# EAGLE schematic Arduino UNO blank shield (EAGLE 7.6.0)
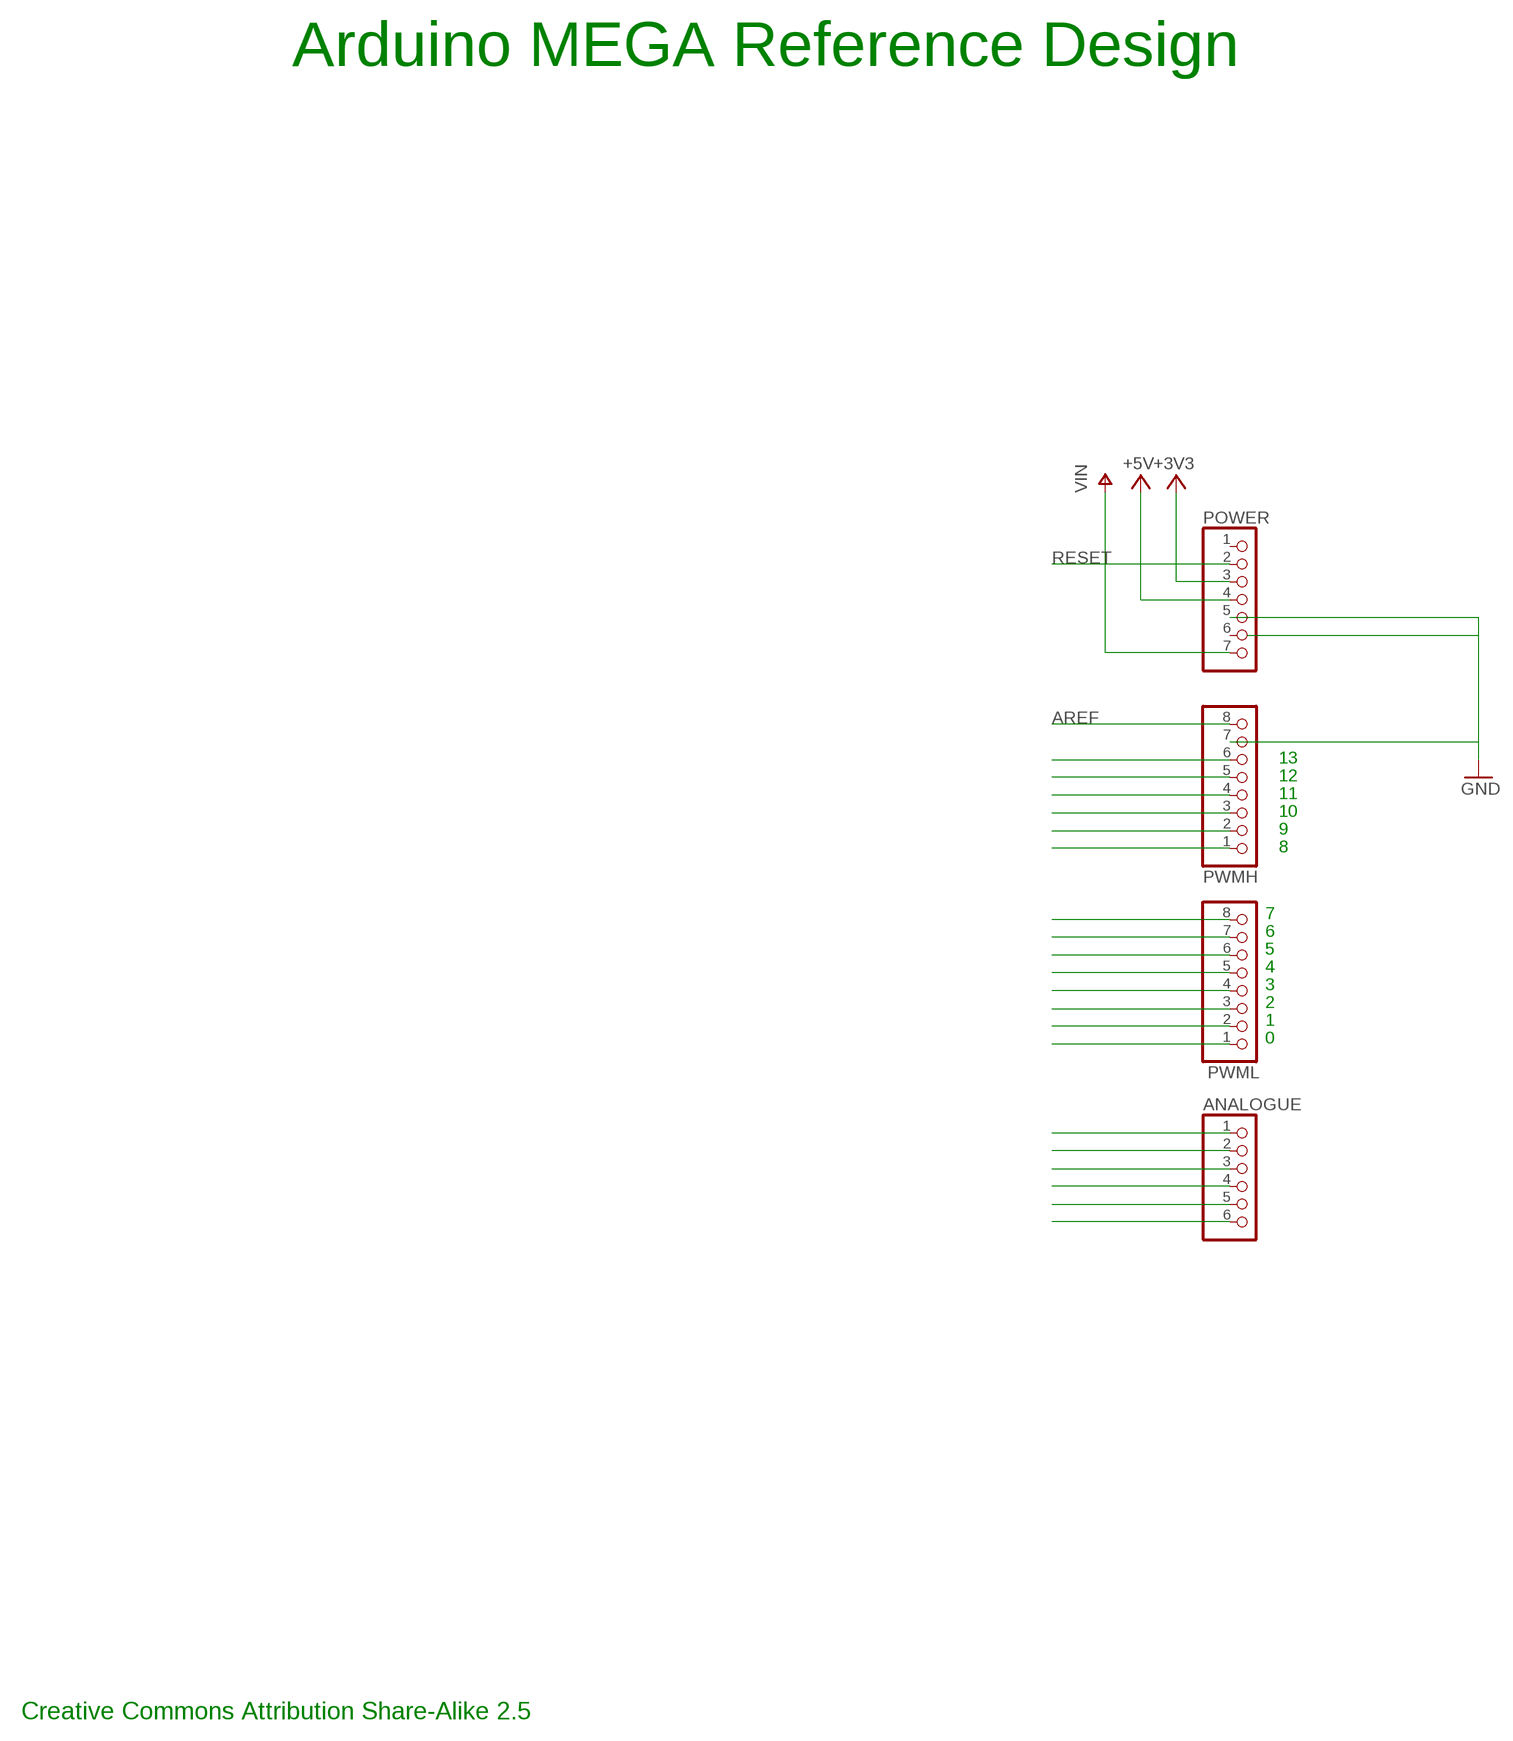
[diagram p0: schematic, sheet 1]

## Parts
ANALOGUE  PINHD-1X6  [1X06]
POWER  PINHD-1X7  [1X07]
PWMH  PINHD-1X8  [1X08]
PWML  PINHD-1X8  [1X08]

## Nets
+3V3 [power]: POWER.3
+5V [usbvcc]: POWER.4
A0: ANALOGUE.1
A1: ANALOGUE.2
A2: ANALOGUE.3
A3: ANALOGUE.4
A4: ANALOGUE.5
A5: ANALOGUE.6
AREF: PWMH.8
DIG0_RX: PWML.1
DIG1_TX: PWML.2
DIG2: PWML.3
DIG3: PWML.4
DIG4: PWML.5
DIG5: PWML.6
DIG6: PWML.7
DIG7: PWML.8
DIG8: PWMH.1
DIG9: PWMH.2
DIG10: PWMH.3
DIG11: PWMH.4
DIG12: PWMH.5
DIG13: PWMH.6
GND [gnd]: POWER.5 PWMH.7
RESET: POWER.2
VIN: POWER.7
Unconnected: POWER.1 POWER.6

## Notes on the sheet
- Arduino MEGA Reference Design
- 13
- 12
- 11
- 10
- 9
- 8
- 7
- 6
- 5
- 4
- 3
- 2
- 1
- 0
- Creative Commons Attribution Share-Alike 2.5

## Library data of the parts
ANALOGUE = pinhead - big pad:PINHD-1X6: PIN HEADER
POWER = pinhead - big pad:PINHD-1X7: PIN HEADER
PWMH PWML = pinhead:PINHD-1X8: PIN HEADER

## Net classes
0 default: width 0.203 mm, drill 0.406 mm, clearance 0.203 mm
1 power: width 0.61 mm, drill 0.711 mm, clearance 0.203 mm
2 gnd: width 0.305 mm, drill 0.711 mm, clearance 0.203 mm
3 usbvcc: width 0.508 mm, drill 0.711 mm, clearance 0.203 mm